# Altium schematic sheet mbed-enablement-platform_F_4.SchDoc: Mbed EP - Power
size A4; Date: 10/26/2017 12:01:24 PM; Revision: Firefly; SheetNumber: 4; SheetTotal: 4
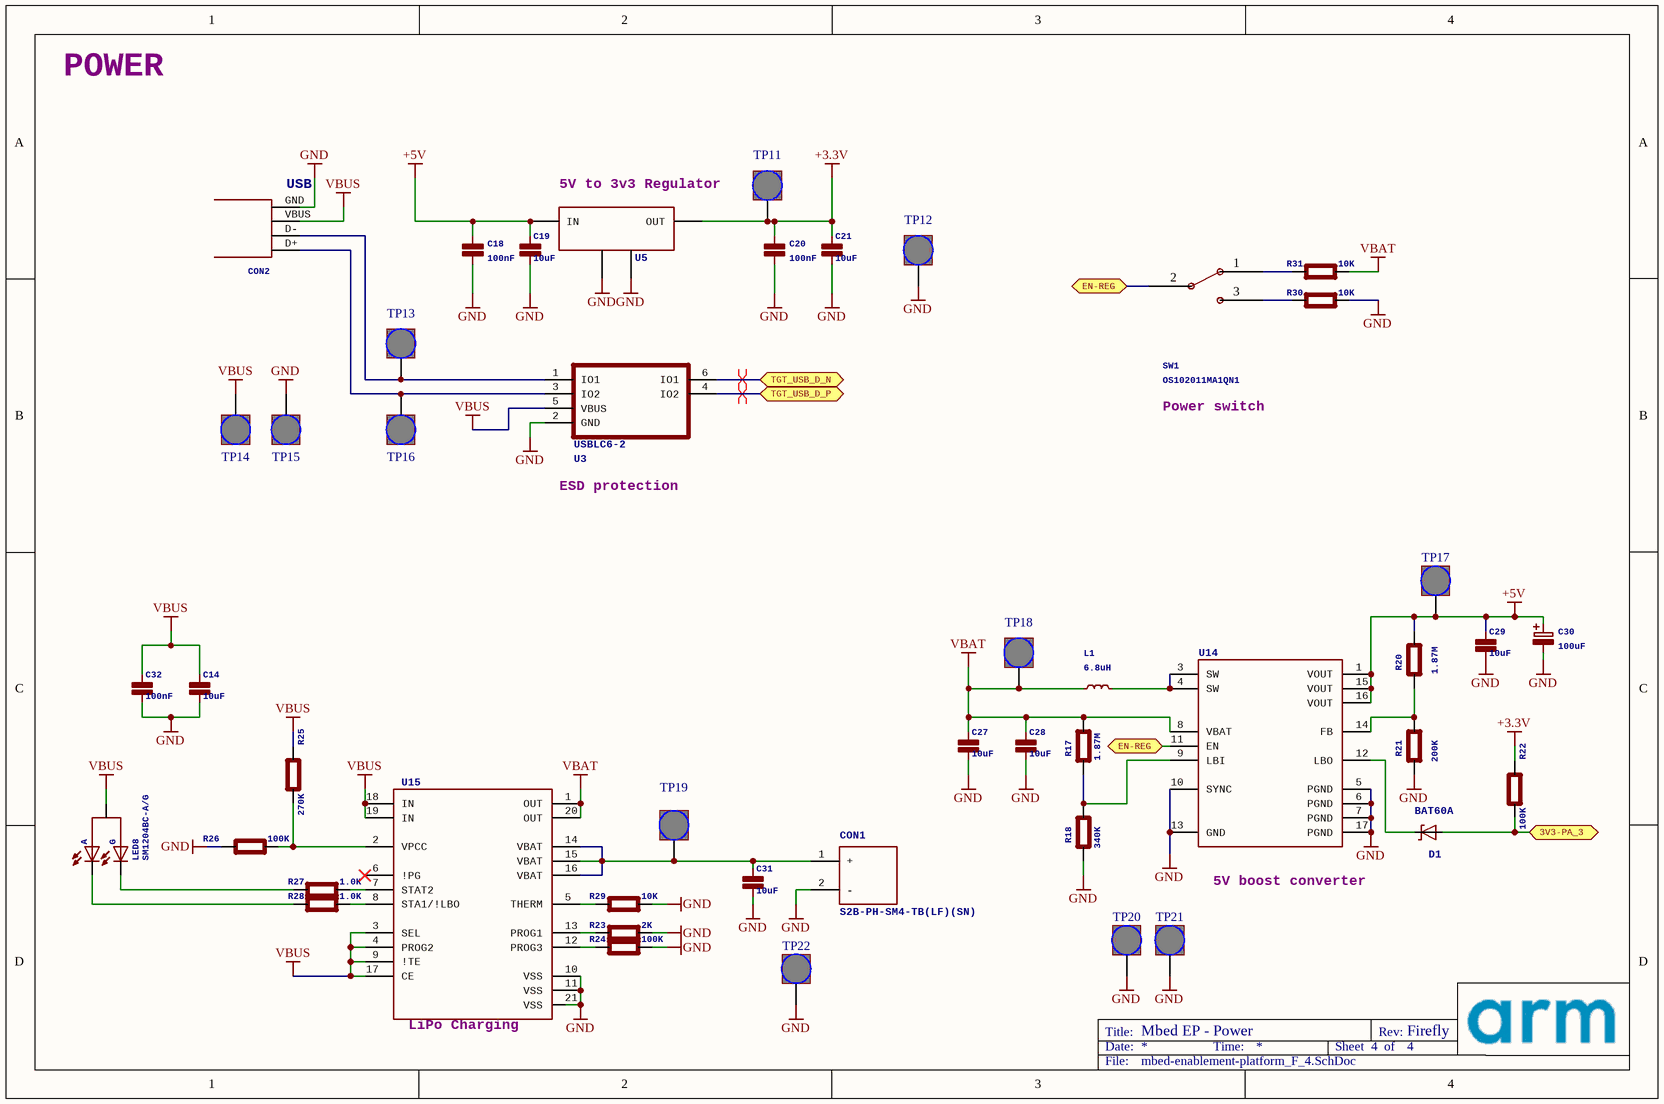
[diagram p0: mbed-enablement-platform_F_4.SchDoc]

## Parts
C14  10uF  [0603]
C18  100nF  [0402]
C19  10uF  [0603]
C20  100nF  [0402]
C21  10uF  [0603]
C27  10uF  [0603]
C28  10uF  [0603]
C29  10uF  [0603]
C30  100uF  [SMC_B]
C31  10uF  [0603]
C32  100nF  [0603]
CON1  S2B-PH-SM4-TB(LF)(SN)  [S2B-PH-SM4-TB(LF)(SN)]
CON2  47346-0001  [USB-MICRO-B-H]  (value not drawn)
D1  BAT60A  [SOD323]
L1  6.8uH  [NR8040T6R8N]
LED8  SM1204BC-A/G  [CHIPLED_1204]
R17  1.87M  [0402]
R18  340K  [0402]
R20  1.87M  [0402]
R21  200K  [0402]
R22  100K  [0402]
R23  2K  [0402]
R24  100K  [0402]
R25  270K  [0402]
R26  100K  [0402]
R27  1.0K  [0402]
R28  1.0K  [0402]
R29  10K  [0402]
R30  10K  [0402]
R31  10K  [0402]
SW1  OS102011MA1QN1  [OS102011MA1QN1]
TP11  TP, 1.5mm  [TP1.5]  (value not drawn)
TP12  TP, 1.5mm  [TP1.5]  (value not drawn)
TP13  TP, 1.5mm  [TP1.5]  (value not drawn)
TP14  TP, 1.5mm  [TP1.5]  (value not drawn)
TP15  TP, 1.5mm  [TP1.5]  (value not drawn)
TP16  TP, 1.5mm  [TP1.5]  (value not drawn)
TP17  TP, 1.5mm  [TP1.5]  (value not drawn)
TP18  TP, 1.5mm  [TP1.5]  (value not drawn)
TP19  TP, 1.5mm  [TP1.5]  (value not drawn)
TP20  TP, 1.5mm  [TP1.5]  (value not drawn)
TP21  TP, 1.5mm  [TP1.5]  (value not drawn)
TP22  TP, 1.5mm  [TP1.5]  (value not drawn)
U3  USBLC6-2SC6SC6  [SOT23-6L]  (value not drawn)
U5  LDO Fixed Regulator 3.3v, 1.5A  [SOT223]  (value not drawn)
U14  Boost Converter 2A Switch, 96% Efficient Boost  [QFN-16]  (value not drawn)
U15  Lithium-Ion/Polymer Charger IC 4.2V (1000mA)  [QFN-20]  (value not drawn)

## Ports
3V3-PA_3, EN-REG, TGT_USB_D_N (bidir), TGT_USB_D_P (bidir)

## Nets
+3.3V: C20.1(P$1) C21.1(P$1) R22.1(P$1) TP11.1 U5.3(OUT)
+5V: C18.1(P$1) C19.1(P$1) C29.1(P$1) C30.+ R20.1(P$1) TP17.1 U5.1(IN) U14.1(VOUT) U14.15(VOUT) U14.16(VOUT)
GND: C14.2(P$2) C18.2(P$2) C19.2(P$2) C20.2(P$2) C21.2(P$2) C27.2(P$2) C28.2(P$2) C29.2(P$2) C30.- C31.2(P$2) C32.2(P$2) CON1.2(-) CON2.GND R18.2(P$2) R21.2(P$2) R23.2(P$2) R24.2(P$2) R26.1(P$1) R29.2(P$2) R30.2(P$2) TP12.1 TP15.1 TP20.1 TP21.1 TP22.1 U3.2(GND) U5.2(GND) U5.4(GND) U14.5(PGND) U14.6(PGND) U14.7(PGND) U14.10(SYNC) U14.13(GND) U14.17(PGND) U15.10(VSS) U15.11(VSS) U15.21(VSS)
VBAT: C27.1(P$1) C28.1(P$1) L1.P$1 R17.1(P$1) R31.2(P$2) TP18.1 U14.8(VBAT) U15.1(OUT) U15.20(OUT)
VBUS: C14.1(P$1) C32.1(P$1) CON2.VBUS LED8.P$1 R25.1(P$1) TP14.1 U3.5(VBUS) U15.3(SEL) U15.4(PROG2) U15.9(!TE) U15.17(CE) U15.18(IN) U15.19(IN)
3V3-PA_3: D1.A R22.2(P$2) ; port 3V3-PA_3
EN-REG: SW1.2 U14.11(EN) ; port EN-REG
TGT_USB_D_N: U3.6(IO1) ; port TGT_USB_D_N
TGT_USB_D_P: U3.4(IO2) ; port TGT_USB_D_P
NetC31_1: C31.1(P$1) CON1.1(+) TP19.1 U15.14(VBAT) U15.15(VBAT) U15.16(VBAT)
NetCON2_D+: CON2.D+ TP16.1 U3.3(IO2)
NetCON2_D-: CON2.D- TP13.1 U3.1(IO1)
NetD1_K: D1.K U14.12(LBO)
NetL1_P$2: L1.P$2 U14.3(SW) U14.4(SW)
NetLED8_P$2: LED8.P$2 R28.1(P$1)
NetLED8_P$3: LED8.P$3 R27.1(P$1)
NetR17_2: R17.2(P$2) R18.1(P$1) U14.9(LBI)
NetR20_2: R20.2(P$2) R21.1(P$1) U14.14(FB)
NetR23_1: R23.1(P$1) U15.13(PROG1)
NetR24_1: R24.1(P$1) U15.12(PROG3)
NetR25_2: R25.2(P$2) R26.2(P$2) U15.2(VPCC)
NetR27_2: R27.2(P$2) U15.7(STAT2)
NetR28_2: R28.2(P$2) U15.8(STA1/!LBO)
NetR29_1: R29.1(P$1) U15.5(THERM)
NetR30_1: R30.1(P$1) SW1.3
NetR31_1: R31.1(P$1) SW1.1

Not connected (* = marked no-connect by the designer): U15 6(!PG)*

## Layout directives
differential pair: TGT_USB_D_N, TGT_USB_D_P

## Notes on the sheet
- POWER
- (near U5) 5V to 3v3 Regulator
- Power switch
- (near U3) ESD protection
- (near U14) 5V boost converter
- (near U15) LiPo Charging
- Title:
- Date:
- Time:
- Sheet
- Rev:
- of
- File:

## Library data of the parts
C14 C19 C21 C27-C29 C31 C32 = CAPACITOR0603: Capacitor
C18 C20 = CAPACITOR0402: Capacitor
C30 = CAPACITOR-POLARISEDB: Polarised capacitor; MF: Kemet; MFN: T491B106K020AT; OC-DIGIKEY: 399-8298-1-ND; OC-MOUSER: 80-T491B106K020; OC-NEWARK: 57K1740
CON1 = S2B-PH-SM4-TB(LF)(SN): 2 Position 2 mm JST PH Series Pitch Surface Mount Side Entry Shrouded Header; MF: JST; MFN: S2B-PH-SM4-TB(LF)(SN); OC-DIGIKEY: 455-1749-1-ND; OC-MOUSER: *; OC-NEWARK: 38K8067
CON2 = 47346-0001: USB Receptacle Horizontal Micro Type B; MF: MOLEX; MFN: 47346-0001; OC-DIGIKEY: WM17141CT-ND; OC-MOUSER: 538-47346-0001; OC-NEWARK: 1568026; USB: USB
D1 = BAT60A: SCHOTTKY DIODE; MF: Infineon; MFN: BAT60AE6327HTSA1; OC-DIGIKEY: BAT60AE6327HTSA1CT-ND; OC-MOUSER: 726-BAT60AE6327; OC-NEWARK: 85X4127
L1 = INDUCTORNR8040T6R8N: Inductor; MF: Taiyo Yuden; MFN: NR8040T6R8N; OC-DIGIKEY: 587-2000-1-ND; OC-MOUSER: 963-NR8040T6R8N; OC-NEWARK: *
LED8 = SM1204BC-A/G: Dual Colour LED SMD Right Angle, Colour Amber/Green; MF: Bivar; MFN: SM1204BC-A/G; OC-DIGIKEY: 492-1229-2-ND; OC-MOUSER: 749-SM1204BC-A/G; OC-NEWARK: 1814269; G: G; A: A
R17 R18 R20-R31 = RESISTOR0402: Resistor
SW1 = OS102011MA1QN1: SWITCH SLIDE SPDT 100MA 12V; MF: C&K Components; MFN: OS102011MA1QN1
TP11-TP22 = TP1.5: 1.5mm round test point
U3 = USBLC6-2SC6SC6: ESD USB Protection Bi-Directional; MF: STMicroelectronics; MFN: USBLC6-2SC6; OC-DIGIKEY: 497-5235-1-ND; OC-MOUSER: 511-USBLC6-2SC6; OC-NEWARK: 26M4748; USBLC6-2: USBLC6-2
U5 = TL1963A-33DCYR: MF: Texas Instruments; MFN: TL1963A-33DCYR; OC-DIGIKEY: 296-24897-1-ND; OC-MOUSER: 595-TL1963A-33DCYR; OC-NEWARK: 94T5083
U14 = TPS61090RSAR: MF: Texas Instruments; MFN: TPS61090RSAR; OC-DIGIKEY: 296-15259-1-ND; OC-MOUSER: 595-TPS61090RSAR; OC-NEWARK: 73H4652
U15 = MCP73871-2CCI/ML: MF: Microchip; MFN: MCP73871-2CCI/ML; OC-DIGIKEY: MCP73871-2CCI/ML-ND; OC-MOUSER: 579-MCP73871-2CCI/ML; OC-NEWARK: 1642489